# EAGLE design MoleNet_v3.0 (EAGLE 7.6.0)
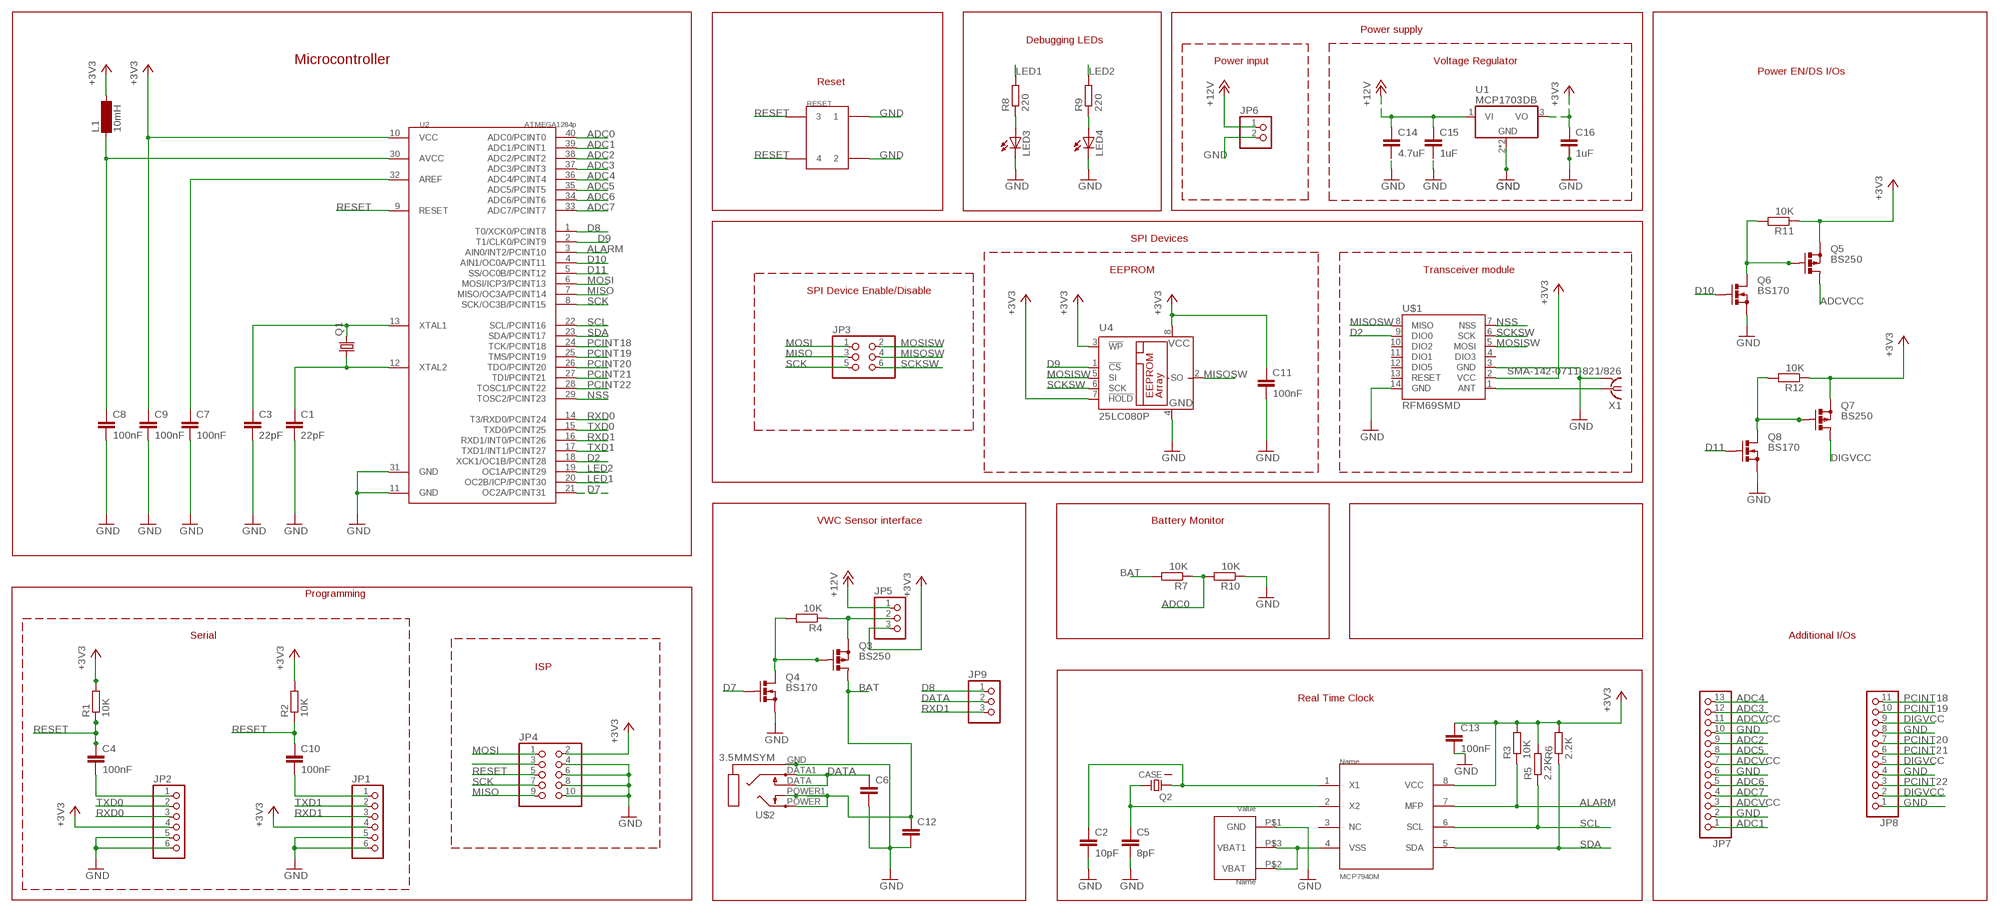
[diagram p0: schematic, sheet 1]

## Parts
C1  22pF  C-EU025-025X050  [C025-025X050]
C2  10pF  C-EU025-025X050  [C025-025X050]
C3  22pF  C-EU025-025X050  [C025-025X050]
C4  100nF  C-EU025-025X050  [C025-025X050]
C5  8pF  C-EU025-025X050  [C025-025X050]
C6  C-EU025-025X050  [C025-025X050]
C7  100nF  C-EU025-025X050  [C025-025X050]
C8  100nF  C-EU025-025X050  [C025-025X050]
C9  100nF  C-EU025-025X050  [C025-025X050]
C10  100nF  C-EU025-025X050  [C025-025X050]
C11  100nF  C-EU025-025X050  [C025-025X050]
C12  C-EU025-025X050  [C025-025X050]
C13  100nF  C-EU025-025X050  [C025-025X050]
C14  4.7uF  C-EU025-025X050  [C025-025X050]
C15  1uF  C-EU025-025X050  [C025-025X050]
C16  1uF  C-EU025-025X050  [C025-025X050]
JP1  PINHD-1X6  [1X06]
JP2  PINHD-1X6  [1X06]
JP3  PINHD-2X3  [2X03]
JP4  PINHD-2X5  [2X05]
JP5  PINHD-1X3  [1X03]
JP6  PINHD-1X2  [1X02]
JP7  PINHD-1X13  [1X13]
JP8  PINHD-1X11  [1X11]
JP9  PINHD-1X3  [1X03]
L1  10mH  BS11  [BS11]
LED3  LEDLD260  [LD260]
LED4  LEDLD260  [LD260]
Q1  CRYSTALHC18U-V  [HC18U-V]
Q2  MS1V-T1K-32.768KHZ/12.5PF/20PPM/TA/QC  [MS1V-T1K]
Q3  BS250  [SOT54E]
Q4  BS170  [SOT54E]
Q5  BS250  [SOT54E]
Q6  BS170  [SOT54E]
Q7  BS250  [SOT54E]
Q8  BS170  [SOT54E]
R1  10K  R-EU_0207/10  [0207/10]
R2  10K  R-EU_0207/10  [0207/10]
R3  10K  R-EU_0207/10  [0207/10]
R4  10K  R-EU_0207/10  [0207/10]
R5  2.2K  R-EU_0207/10  [0207/10]
R6  2.2K  R-EU_0207/10  [0207/10]
R7  10K  R-EU_0207/10  [0207/10]
R8  220  R-EU_0207/10  [0207/10]
R9  220  R-EU_0207/10  [0207/10]
R10  10K  R-EU_0207/10  [0207/10]
R11  10K  R-EU_0207/10  [0207/10]
R12  10K  R-EU_0207/10  [0207/10]
RESET  RESDEV  [PDIP-4]
U1  MCP1703DB  [SOT223]
U2  ATMEGA1284p  MEGA1284P  [DIL40]
U4  25LC080P  [DIL8]
U5  MCP7940M  [DIP8]
U7  BATHOLDER  [BATDIP]
U$1  RFM69SMD  [RFM69]
U$2  3.5MMSYM  [PDIP5]
X1  SMA-142-0711-821/826  [J502-ND-142-0711-821/826]

## Nets
+3V3: C9.1 C11.1 C13.1 C16.1 JP1.4 JP2.4 JP4.2 JP5.3 L1.2 Q5.S Q7.S R1.2 R2.2 R3.2 R5.2 R6.2 R11.1 R12.1 U1.3(VO) U2.10(VCC) U4.3(!WP) U4.7(!HOLD) U4.8(VCC) U5.8(VCC) U$1.2(VCC)
+12V: C14.1 C15.1 JP5.1 JP6.1 U1.1(VI)
ADC0: R7.1 R10.2 U2.40(ADC0/PCINT0)
ADC1: JP7.1 U2.39(ADC1/PCINT1)
ADC2: JP7.9 U2.38(ADC2/PCINT2)
ADC3: JP7.12 U2.37(ADC3/PCINT3)
ADC4: JP7.13 U2.36(ADC4/PCINT4)
ADC5: JP7.8 U2.35(ADC5/PCINT5)
ADC6: JP7.5 U2.34(ADC6/PCINT6)
ADC7: JP7.4 U2.33(ADC7/PCINT7)
ADCVCC: JP7.3 JP7.7 JP7.11 Q5.D
ALARM: R3.1 U2.3(AIN0/INT2/PCINT10) U5.7(MFP)
BAT: C12.1 JP5.2 Q3.D Q3.S R4.1 R7.2 U$2.POWER U$2.POWER1
D2: U2.18(XCK1/OC1B/PCINT28) U$1.9(DIO0)
D7: Q4.G U2.21(OC2A/PCINT31)
D8: JP9.1 U2.1(T0/XCK0/PCINT8)
D9: U2.2(T1/CLK0/PCINT9) U4.1(!CS)
D10: Q6.G U2.4(AIN1/OC0A/PCINT11)
D11: Q8.G U2.5(SS/OC0B/PCINT12)
DATA: C6.1 JP9.2 U$2.DATA U$2.DATA1
DIGVCC: JP8.2 JP8.5 JP8.9 Q7.D
GND: C1.2 C2.2 C3.2 C5.2 C6.2 C7.2 C8.2 C9.2 C11.2 C12.2 C13.2 C14.2 C15.2 C16.2 JP1.5 JP1.6 JP2.5 JP2.6 JP4.4 JP4.6 JP4.8 JP4.10 JP6.2 JP7.2 JP7.6 JP7.10 JP8.1 JP8.4 JP8.8 LED3.K(C) LED4.K(C) Q4.S Q6.S Q8.S R10.1 RESET.1 RESET.2 U1.2(GND) U1.4(GND) U2.11(GND) U2.31(GND) U4.4(GND) U7.P$1(GND) U$1.3(GND) U$1.14(GND) U$2.GND X1.G@1 X1.G@2 X1.G@3 X1.G@4
LED1: R8.2 U2.20(OC2B/ICP/PCINT30)
LED2: R9.2 U2.19(OC1A/PCINT29)
MISO: JP3.3 JP4.9 U2.7(MISO/OC3A/PCINT14)
MISOSW: JP3.4 U4.2(SO) U$1.8(MISO)
MOSI: JP3.1 JP4.1 U2.6(MOSI/ICP3/PCINT13)
MOSISW: JP3.2 U4.5(SI) U$1.5(MOSI)
N$1: C3.1 Q1.2 U2.13(XTAL1)
N$2: C1.1 Q1.1 U2.12(XTAL2)
N$3: C2.1 Q2.1 U5.1(X1)
N$4: C5.1 Q2.2 U5.2(X2)
N$5: C7.1 U2.32(AREF)
N$6: C4.2 JP2.1
N$7: C8.1 L1.1 U2.30(AVCC)
N$8: C10.2 JP1.1
N$9: U$1.1(ANT) X1.1
N$10: Q5.G Q6.D R11.2
N$11: JP4.3
N$12: LED3.A R8.1
N$13: Q3.G Q4.D R4.2
N$14: LED4.A R9.1
N$15: U5.4(VSS) U7.P$2(VBAT) U7.P$3(VBAT1)
N$30: Q7.G Q8.D R12.2
NSS: U2.29(TOSC2/PCINT23) U$1.7(NSS)
PCINT18: JP8.11 U2.24(TCK/PCINT18)
PCINT19: JP8.10 U2.25(TMS/PCINT19)
PCINT20: JP8.7 U2.26(TDO/PCINT20)
PCINT21: JP8.6 U2.27(TDI/PCINT21)
PCINT22: JP8.3 U2.28(TOSC1/PCINT22)
RESET: C4.1 C10.1 JP4.5 R1.1 R2.1 RESET.3 RESET.4 U2.9(RESET)
RXD0: JP2.3 U2.14(T3/RXD0/PCINT24)
RXD1: JP1.3 JP9.3 U2.16(RXD1/INT0/PCINT26)
SCK: JP3.5 JP4.7 U2.8(SCK/OC3B/PCINT15)
SCKSW: JP3.6 U4.6(SCK) U$1.6(SCK)
SCL: R5.1 U2.22(SCL/PCINT16) U5.6(SCL)
SDA: R6.1 U2.23(SDA/PCINT17) U5.5(SDA)
TXD0: JP2.2 U2.15(TXD0/PCINT25)
TXD1: JP1.2 U2.17(TXD1/INT1/PCINT27)
Unconnected: Q2.CASE U5.3(NC) U$1.4(DIO3) U$1.10(DIO2) U$1.11(DIO1) U$1.12(DIO5)

## Notes on the sheet
- Power supply
- Debugging LEDs
- Microcontroller | Power input | Voltage Regulator
- Power EN/DS I/Os
- Reset
- SPI Devices
- EEPROM | Transceiver module
- SPI Device Enable/Disable
- VWC Sensor interface | Battery Monitor
- Programming
- Serial | Additional I/Os
- ISP
- Real Time Clock

## Power pins joined to a net without a drawn wire
RESET: U$1.13(RESET)

## Library data of the parts
C1-C16 = rcl:C-EU: CAPACITOR, European symbol
JP1 JP2 = pinhead:PINHD-1X6: PIN HEADER
JP3 = pinhead:PINHD-2X3: PIN HEADER
JP4 = pinhead:PINHD-2X5: PIN HEADER
JP5 JP9 = pinhead:PINHD-1X3: PIN HEADER
JP6 = pinhead:PINHD-1X2: PIN HEADER
JP7 = pinhead:PINHD-1X13: PIN HEADER
JP8 = pinhead:PINHD-1X11: PIN HEADER
L1 = inductor-neosid:BS: INDUCTOR nominal inductance, magnetically screened; OC_FARNELL: unknown; OC_NEWARK: unknown
LED3 LED4 = led:LED: LED OSRAM: - CHIPLED LG R971, LG N971, LY N971, LG Q971, LY Q971, LO R971, LY R971 LH N974, LH R974 LS Q976, LO Q976, LY Q976 LO Q996 - Hyper CHIPLED LW Q18S LB Q993, LB Q99A, LB R99A - SideLED LS A670, LO A670, LY A670, LG A670, LP A670 LB A673, LV A673, LT A673, LW A673 LH A674 LY A675 LS A676, LA A676, LO A676, LY A676, LW A676 LS A679, LY A679, LG A679 - Hyper Micro SIDELED® LS Y876, LA Y876, LO Y876, LY Y876 LT Y87S - SmartLED LW L88C, LW L88S LB L89C, LB L89S, LG L890 LS L89K, LO L89K, LY L89K LS L896, LA L896, LO L896, LY L896 - TOPLED LS T670, LO T670, LY T670, LG T670, LP T670 LSG T670, LSP T670, LSY T670, LOP T670, LYG T670 LG T671, LOG T671, LSG T671 LB T673, LV T673, LT T673, LW T673 LH T674 LS T676, LA T676, LO T676, LY T676, LB T676, LH T676, LSB T676, LW T676 LB T67C, LV T67C, LT T67C, LS T67K, LO T67K, LY T67K, LW E67C LS E67B, LA E67B, LO E67B, LY E67B, LB E67C, LV E67C, LT E67C LW T67C LS T679, LY T679, LG T679 LS T770, LO T770, LY T770, LG T770, LP T770 LB T773, LV T773, LT T773, LW T773 LH T774 LS E675, LA E675, LY E675, LS T675 LS T776, LA T776, LO T776, LY T776, LB T776 LHGB T686 LT T68C, LB T68C - Hyper Mini TOPLED® LB M676 - Mini TOPLED Santana® LG M470 LS M47K, LO M47K, LY M47K Source: http://www.osram.convergy.de LUXEON: - LUMILED® LXK2-PW12-R00, LXK2-PW12-S00, LXK2-PW14-U00, LXK2-PW14-V00 LXK2-PM12-R00, LXK2-PM12-S00, LXK2-PM14-U00 LXK2-PE12-Q00, LXK2-PE12-R00, LXK2-PE12-S00, LXK2-PE14-T00, LXK2-PE14-U00 LXK2-PB12-K00, LXK2-PB12-L00, LXK2-PB12-M00, LXK2-PB14-N00, LXK2-PB14-P00, LXK2-PB14-Q00 LXK2-PR12-L00, LXK2-PR12-M00, LXK2-PR14-Q00, LXK2-PR14-R00 LXK2-PD12-Q00, LXK2-PD12-R00, LXK2-PD12-S00 LXK2-PH12-R00, LXK2-PH12-S00 LXK2-PL12-P00, LXK2-PL12-Q00, LXK2-PL12-R00 Source: www.luxeon.com KINGBRIGHT: KA-3528ASYC Source: www.kingbright.com
Q1 = crystal:CRYSTAL: CRYSTAL; OC_FARNELL: unknown; OC_NEWARK: unknown
Q2 = crystal_MS1V-T1K:MS1V-T1K-*: p r e l i m i n a r y 5 . 0 . 0 MS1V-T1K Crystaly source: www.microcrystal.com
Q3 Q5 Q7 = transistor-small-signal:BS250: P-CHANNEL MOS FET
Q4 Q6 Q8 = transistor-small-signal:BS170: N-CHANNEL MOS FET
R1-R12 = rcl:R-EU_: RESISTOR, European symbol
RESET = resetswitch:RESDEV
U1 = mcp1703:MCP1703: 250 mA, 16V, Low Quiescent Current LDO Regulator Source: http://ww1.microchip.com/downloads/en/DeviceDoc/22049b.pdf
U2 = 1284p:MEGA1284P: Atmel ATmega1284P 8-bit AVR Microcontroller
U4 = microchip:25*: Serial EEPROM 4K/ 8K , SPI bus; MF: MICROCHIP; MPN: 25LC080/P; OC_FARNELL: 1556143; OC_NEWARK: 92C7440
U5 = mcp7940m:MCP7940M
U7 = batholder:BATHOLDER
U$1 = RFM69:RFM69: The RFM22 is a low-power, low cost radio that is capable of operating in the 434MHz and 900MHz open bands. It's frequency is software defined and there are some very good libraries written for it.
U$2 = 3.5mmjack:3.5MMSYM
X1 = con-coax:SMA-: SMA 50 Ohm End Launch Jack Receptacle - Round Contact Johnson Components Source: www.johnsoncomponents.com .. J502-ND.pdf; MF: JOHNSON COMPONENTS; MPN: 142-0711-821; OC_FARNELL: 1019328; OC_NEWARK: 16F3627

## Board
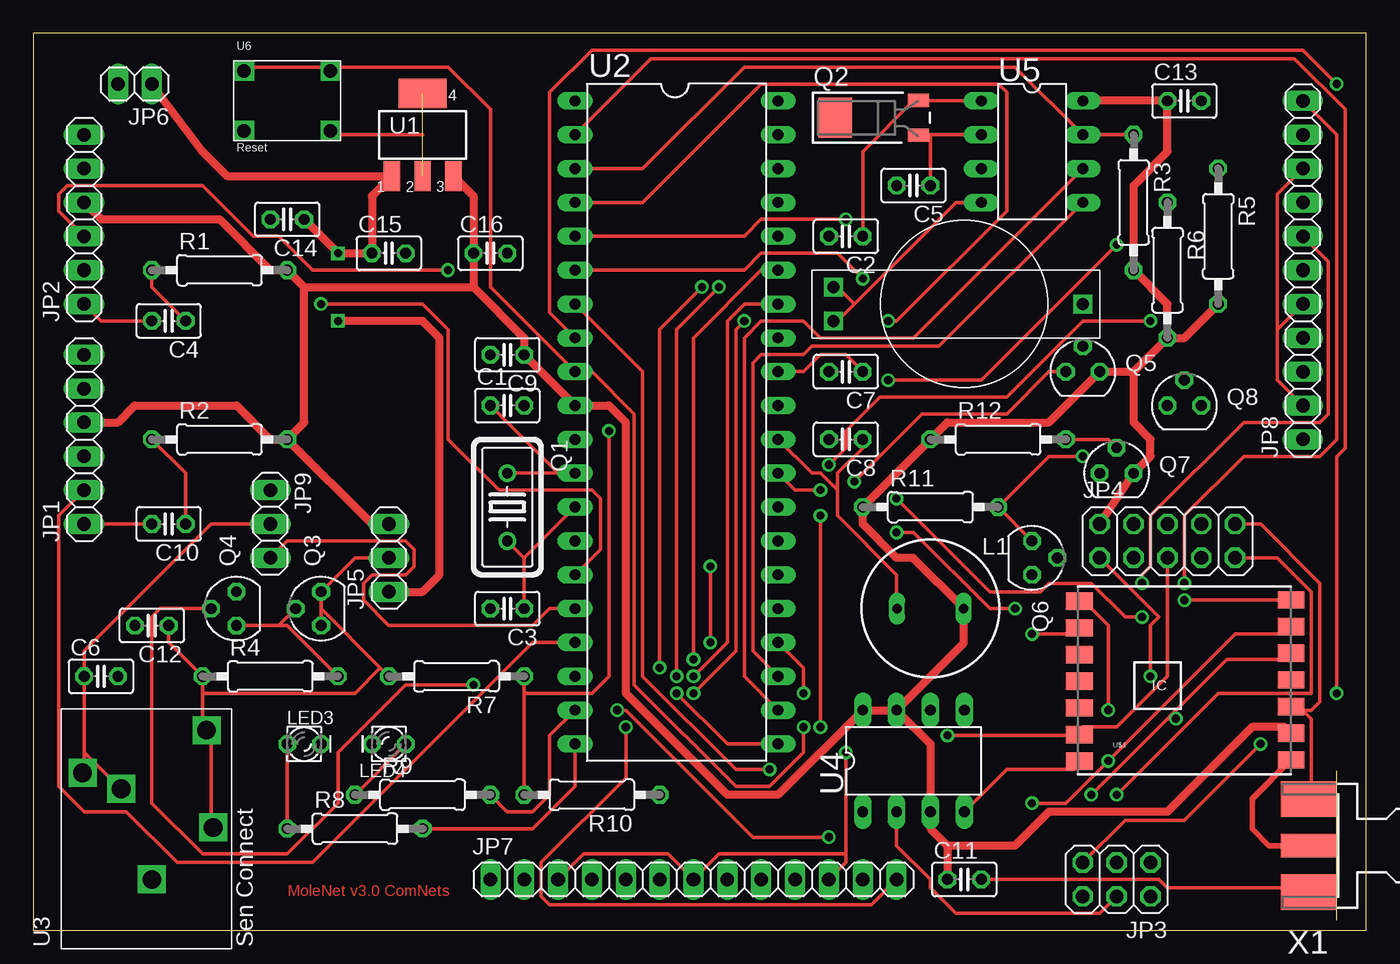
[diagram p1: board, top side]
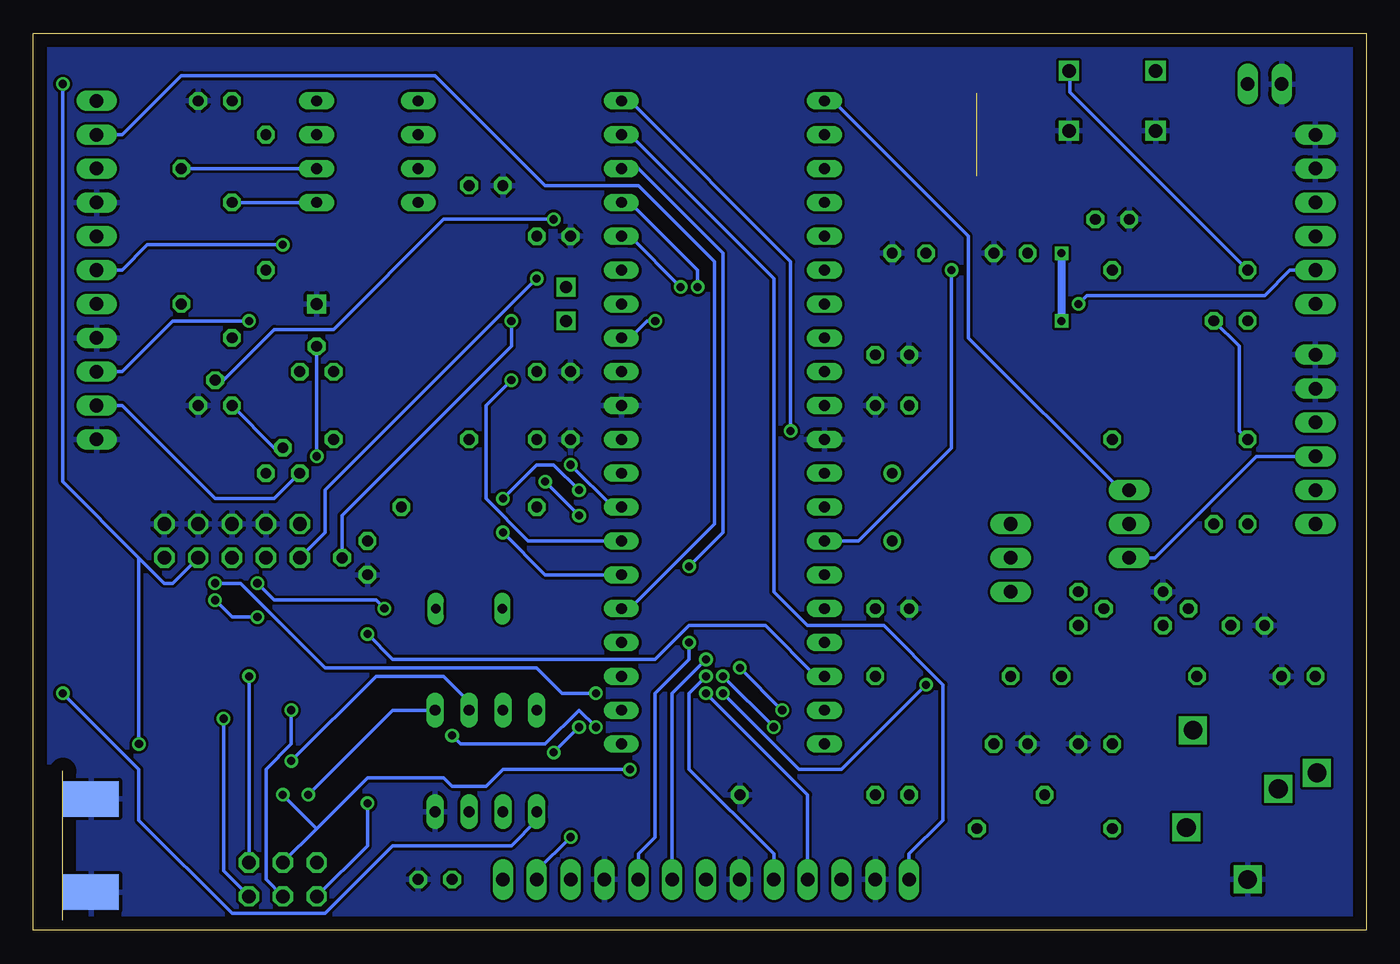
[diagram p2: board, bottom side, seen from below]

Size 100 x 67.3 mm. Coordinates in mm from the lower left corner, seen from the top.
Outline: 0,0 100,0 100,67.3 0,67.3 0,0
Copper layers (1*16): Top 0.035mm / dielectric 1.5mm / Bottom 0.035mm
Design rules "default": minimum track width 10mil, minimum drill 24mil, track to track 8mil, track to pad 8mil, pad to pad 8mil, via to via 8mil, smd to smd 8mil, copper to edge 40mil, drill to drill 8mil, minimum pad ring 10mil, minimum via ring 8mil, stop-mask expansion 4mil, vias tented up to drill 0mil, thermal gap 10mil

### Footprints (pad centres in the part's own frame; a part is rotated, then mirrored left to right if it is on the bottom)
C025-025X050 = drill 0.813 octagon: 1 -1.27,0; 2 1.27,0
1X06 = drill 1.016 long: 1 -6.35,0; 2 -3.81,0; 3 -1.27,0; 4 1.27,0; 5 3.81,0; 6 6.35,0
2X03 = drill 1.016 octagon: 1 -2.54,-1.27; 2 -2.54,1.27; 3 0,-1.27; 4 0,1.27; 5 2.54,-1.27; 6 2.54,1.27
2X05 = drill 1.016 octagon: 1 -5.08,-1.27; 2 -5.08,1.27; 3 -2.54,-1.27; 4 -2.54,1.27; 5 0,-1.27; 6 0,1.27; 7 2.54,-1.27; 8 2.54,1.27; 9 5.08,-1.27; 10 5.08,1.27
1X03 = drill 1.016 long: 1 -2.54,0; 2 0,0; 3 2.54,0
1X02 = drill 1.016 long: 1 -1.27,0; 2 1.27,0
1X13 = drill 1.016 long: 1 -15.24,0; 2 -12.7,0; 3 -10.16,0; 4 -7.62,0; 5 -5.08,0; 6 -2.54,0; 7 0,0; 8 2.54,0; 9 5.08,0; 10 7.62,0; 11 10.16,0; 12 12.7,0; 13 15.24,0
1X11 = drill 1.016 long: 1 -12.7,0; 2 -10.16,0; 3 -7.62,0; 4 -5.08,0; 5 -2.54,0; 6 0,0; 7 2.54,0; 8 5.08,0; 9 7.62,0; 10 10.16,0; 11 12.7,0
BS11 = drill 0.7 long: 1 -2.5,0; 2 2.5,0
LD260 = drill 0.813 octagon: A -1.27,0; K 1.27,0
HC18U-V = drill 0.813: 1 -2.54,0; 2 2.54,0
MS1V-T1K = smd 1.6 x 1: 1 2.9,1.3; 2 2.9,-1.3 | smd 2.5 x 3: CASE -3.35,0
SOT54E = drill 0.813 octagon: D -1.27,0; G 0,1.905; S 1.27,0
0207/10 = drill 0.813 octagon: 1 -5.08,0; 2 5.08,0
PDIP-4 = drill 1 square: 1 3.25,-2.25; 2 -3.25,-2.25; 3 3.25,2.25; 4 -3.25,2.25
SOT223 = smd 1.219 x 2.235: 1 -2.311,-3.099; 2 0,-3.099; 3 2.311,-3.099 | smd 3.6 x 2.2: 4 0,3.099
DIL40 = drill 0.813 long: 1 -24.13,-7.62; 2 -21.59,-7.62; 3 -19.05,-7.62; 4 -16.51,-7.62; 5 -13.97,-7.62; 6 -11.43,-7.62; 7 -8.89,-7.62; 8 -6.35,-7.62; 9 -3.81,-7.62; 10 -1.27,-7.62; 11 1.27,-7.62; 12 3.81,-7.62; 13 6.35,-7.62; 14 8.89,-7.62; 15 11.43,-7.62; 16 13.97,-7.62; 17 16.51,-7.62; 18 19.05,-7.62; 19 21.59,-7.62; 20 24.13,-7.62; 21 24.13,7.62; 22 21.59,7.62; 23 19.05,7.62; 24 16.51,7.62; 25 13.97,7.62; 26 11.43,7.62; 27 8.89,7.62; 28 6.35,7.62; 29 3.81,7.62; 30 1.27,7.62; 31 -1.27,7.62; 32 -3.81,7.62; 33 -6.35,7.62; 34 -8.89,7.62; 35 -11.43,7.62; 36 -13.97,7.62; 37 -16.51,7.62; 38 -19.05,7.62; 39 -21.59,7.62; 40 -24.13,7.62
DIL8 = drill 0.813 long: 1 -3.81,-3.81; 2 -1.27,-3.81; 3 1.27,-3.81; 4 3.81,-3.81; 5 3.81,3.81; 6 1.27,3.81; 7 -1.27,3.81; 8 -3.81,3.81
DIP8 = drill 0.813 long: 1 -3.81,3.81; 2 -3.81,1.27; 3 -3.81,-1.27; 4 -3.81,-3.81; 5 3.81,-3.81; 6 3.81,-1.27; 7 3.81,1.27; 8 3.81,3.81
BATDIP = drill 0.9 square: P$1 0,0; P$2 18.7,-1.27; P$3 18.7,1.27
RFM69 = smd 2 x 1.3: 1 8,-6.27; 2 8,-4.27; 3 8,-2.27; 4 8,-0.27; 5 8,1.73; 6 8,3.73; 7 8,5.73; 8 -7.875,5.635; 9 -7.875,3.635; 10 -7.875,1.635; 11 -7.875,-0.365; 12 -7.875,-2.365; 13 -7.875,-4.365; 14 -7.875,-6.365
PDIP5 = drill 1.4 square: DATA 6.8,2.3; DATA1 8,5.2; GND 0,0; POWER 3.9,-4.6; POWER1 11.2,-4.1
J502-ND-142-0711-821/826 = smd 4.191 x 1.778: 1 2.115,0 | smd 4.191 x 2.667: G@1 2.115,3.495; G@2 2.115,-3.495 | smd 4.191 x 2.667 bottom: G@3 2.115,3.495; G@4 2.115,-3.495

### Placement (x,y rotation side)
C1  35.56,39.37 0 top
C2  60.96,52.07 180 top
C3  35.56,24.13 180 top
C4  10.16,45.72 180 top
C5  66.04,55.88 180 top
C6  5.08,19.05 0 top
C7  60.96,41.91 180 top
C8  60.96,36.83 180 top
C9  35.56,43.18 180 top
C10  10.16,30.48 180 top
C11  69.85,3.81 0 top
C12  8.89,22.86 180 top
C13  86.36,62.23 0 top
C14  19.05,53.34 180 top
C15  26.67,50.8 0 top
C16  34.29,50.8 0 top
JP1  3.81,36.83 90 top
JP2  3.81,53.34 90 top
JP3  81.28,3.81 180 top
JP4  85.09,29.21 0 top
JP5  26.67,27.94 90 top
JP6  7.62,63.5 180 top
JP7  49.53,3.81 0 top
JP8  95.25,49.53 90 top
JP9  17.78,30.48 270 top
L1  67.31,24.13 0 top
LED3  20.32,13.97 0 top
LED4  26.67,13.97 180 top
Q1  35.56,31.75 270 top
Q2  63.5,60.96 0 top
Q3  21.59,24.13 90 top
Q4  15.24,24.13 90 top
Q5  78.74,41.91 0 top
Q6  74.93,27.94 270 top
Q7  81.28,34.29 0 top
Q8  86.36,39.37 0 top
R1  13.97,49.53 0 top
R2  13.97,36.83 0 top
R3  82.55,54.61 270 top
R4  17.78,19.05 0 top
R5  88.9,52.07 270 top
R6  85.09,49.53 270 top
R7  31.75,19.05 180 top
R8  24.13,7.62 0 top
R9  29.21,10.16 0 top
R10  41.91,10.16 180 top
R11  67.31,31.75 0 top
R12  72.39,36.83 0 top
RESET  19.05,62.23 0 top
U1  29.21,59.69 0 top
U2  48.26,38.1 270 top
U4  66.04,12.7 0 top
U5  74.93,58.42 0 top
U7  78.74,46.99 180 top
U$1  86.36,19.05 0 top
U$2  8.89,3.81 90 top
X1  97.79,6.35 180 top

### Tracks (layer width: path | path; a pad name or v marks a point on that pad's centre or on a via)
+3V3
  Top 0.61: U1.3 33.02,55.09 C16.1 33.02,48.26 | 33.02,48.26 36.83,44.45 C9.1 U2.10 43.18,39.37 44.45,38.1 44.45,17.78 52.07,10.16 55.88,10.16 U4.8 U4.7 | 20.32,48.26 R1.2 17.78,49.53 13.97,53.34 5.08,53.34 JP2.4 | 20.32,48.26 33.02,48.26 | R2.2 20.32,38.1 20.32,48.26 | JP1.4 6.35,38.1 7.62,39.37 15.24,39.37 17.78,36.83 R2.2 | R2.2 25.4,30.48 JP5.3 | U4.7 69.81,21.55 L1.2 66,27.94 64.77,27.94 62.23,30.48 R11.1 R12.1 68.58,38.1 76.2,38.1 Q5.S 82.55,41.91 | 82.55,41.91 R6.2 | R6.2 86.36,44.45 R5.2 | R6.2 85.09,46.99 R3.2 82.55,55.88 85.09,58.42 C13.1 U5.8 | JP4.2 Q7.S 83.82,35.56 83.82,36.83 82.55,38.1 82.55,41.91 | U$1.2 93.9,15.24 91.44,15.24 85.09,8.89 76.2,8.89 73.66,6.35 68.58,6.35 | 68.58,6.35 67.31,7.62 U4.3 67.31,13.97 U4.7 | 68.58,6.35 C11.1
+12V  (via drill 0.6)
  Top 0.61: JP6.1 12.7,58.42 14.53,56.59 U1.1 25.4,55.09 C15.1 v22.86,50.8 C14.1 | JP5.1 29.21,25.4 30.48,26.67 30.48,44.45 29.21,45.72 v22.86,45.72
  Bottom 0.61: v22.86,50.8 v22.86,45.72
ADC0  (via drill 0.61)
  Top 0.254: R7.1 36.83,17.78 | 36.83,17.78 R10.2 | v43.18,37.46 43.18,19.05 41.91,17.78 36.83,17.78
  Bottom 0.254: U2.40 55.25,62.23 43.18,50.16 v43.18,37.46
ADC1
  Bottom 0.254: U2.39 55.25,59.69 44.45,48.9 44.45,25.4 41.91,22.86 36.2,22.86 31.75,18.41 31.75,8.26 34.29,5.71 JP7.1
ADC2  (via drill 0.61)
  Top 0.254: v50.8,21.59 v50.8,27.3
  Bottom 0.254: U2.38 54.61,57.15 48.26,50.8 48.26,29.84 v50.8,27.3 | v50.8,21.59 50.8,20.32 53.34,17.78 53.34,6.99 54.61,5.71 JP7.9
ADC3  (via drill 0.61)
  Top 0.254: v50.16,48.26 46.99,45.09 v46.99,19.68 | v43.82,16.51 44.45,16.51 53.98,6.99 v59.69,6.99
  Bottom 0.254: U2.37 55.25,54.61 50.16,49.53 v50.16,48.26 | v43.82,16.51 v46.99,19.68 | v59.69,6.99 62.23,4.44 JP7.12
ADC4  (via drill 0.61)
  Top 0.254: v51.44,48.26 48.26,45.09 v48.26,19.05 | v44.45,15.24 44.45,11.43 38.1,5.08 38.1,2.54 38.73,1.9 62.86,1.9 JP7.13
  Bottom 0.254: U2.36 55.25,52.07 v51.44,48.26 | v44.45,15.24 v48.26,19.05
ADC5  (via drill 0.61)
  Top 0.254: U2.35 54.61,49.53 49.53,44.45 v49.53,20.32
  Bottom 0.254: v49.53,20.32 52.07,17.78 JP7.8
ADC6  (via drill 0.61)
  Top 0.254: U2.34 53.34,46.99 52.07,45.72 52.07,21.59 v49.53,19.05
  Bottom 0.254: v49.53,19.05 50.8,17.78 50.8,12.06 44.45,5.71 JP7.5
ADC7  (via drill 0.61)
  Top 0.254: v53.34,45.72 52.7,45.09 52.7,20.95 v49.53,17.78
  Bottom 0.254: U2.33 55.25,44.45 53.98,45.72 v53.34,45.72 | v49.53,17.78 41.91,10.16 JP7.4
ADCVCC  (via drill 0.61)
  Top 0.254: JP7.3 41.27,5.71 47.62,5.71 JP7.7 51.44,5.71 60.96,5.71 | Q5.D 76.2,41.91 73.03,38.73 66.67,38.73 v61.59,33.66 | v59.06,15.24 v59.06,31.11 | 60.96,5.71 60.96,5.08 JP7.11 | 60.96,5.71 v60.96,13.33
  Bottom 0.254: v59.06,31.11 v61.59,33.66 | v60.96,13.33 v59.06,15.24
ALARM
  Top 0.254: U2.3 45.72,57.15 53.34,64.77 73.66,64.77 U5.7 R3.1
BAT
  Top 0.254: 21.59,24.13 Q3.S 24.13,27.94 JP5.2 | 21.59,24.13 Q3.D | 21.59,24.13 26.03,19.68 | 26.03,19.68 R7.2 | 12.7,17.78 12.7,15.24 U$2.POWER1 13.33,14.6 13.33,8.26 U$2.POWER | 12.7,17.78 R4.1 10.16,21.59 C12.1 | 26.03,19.68 24.13,17.78 12.7,17.78
D2  (via drill 0.61)
  Top 0.254: v74.93,22.23 78.11,22.23 U$1.9
  Bottom 0.254: v74.93,22.23 73.03,20.32 53.34,20.32 50.8,22.86 45.09,22.86 41.27,19.05 U2.18
D7  (via drill 0.61)
  Top 0.254: Q4.G 9.53,24.13 8.89,23.49 8.89,9.53 12.7,5.71 19.05,5.71 22.86,9.53 22.86,13.33 27.94,18.41 v33.02,18.41 | v48.26,17.78 52.07,13.97 U2.21
  Bottom 0.254: v33.02,18.41 39.37,12.06 42.55,12.06 v48.26,17.78
D8
  Bottom 0.254: U2.1 40.01,62.23 29.84,52.07 29.84,44.45 18.41,33.02 JP9.1
D9  (via drill 0.61)
  Top 0.254: v97.79,17.78 97.79,35.56 98.42,36.2 98.42,61.59 94.61,65.41 46.36,65.41 U2.2
  Bottom 0.254: U4.1 62.23,8.26 64.14,6.35 73.03,6.35 78.11,1.27 85.09,1.27 92.08,8.26 92.08,12.06 v97.79,17.78
D10  (via drill 0.61)
  Top 0.254: U2.4 45.72,54.61 54.61,63.5 72.39,63.5 73.03,62.87 73.03,53.98 64.77,45.72 v64.14,45.72
  Bottom 0.254: v64.14,45.72 64.14,43.81 76.84,31.11 Q6.G
D11  (via drill 0.61)
  Top 0.254: U2.5 53.34,52.07 54.61,53.34 v60.96,53.34
  Bottom 0.254: v60.96,53.34 69.22,53.34 77.47,45.09 81.92,45.09 85.73,41.27 Q8.G
DATA
  Top 0.254: 3.81,13.33 3.81,12.06 U$2.DATA1 | 3.81,13.33 C6.1 3.81,20.95 13.33,30.48 JP9.2 | 3.81,13.33 6.35,10.79 U$2.DATA
DIGVCC
  Top 0.254: 93.34,45.09 JP8.5 | 93.34,45.09 93.34,41.27 JP8.2 | JP8.9 93.34,55.24 93.34,45.09
  Bottom 0.254: Q7.D 81.92,32.38 86.36,32.38 93.34,39.37 JP8.2
GND  (2 unrouted)
  Top 0.254: 95.25,16.51 94.61,16.51 U$1.3 95.25,16.51 | 95.25,16.51 95.89,15.87 95.89,10.16 X1.G@4 | U4.4 73.03,12.06 78.11,12.06 U$1.14 | C11.2 84.45,3.81 85.09,3.17 95.25,3.17 X1.G@3 | 29.21,59.69 22.86,59.69 RESET.1 | 95.25,16.51 95.89,16.51 96.52,17.14 96.52,26.03 92.08,30.48 JP4.10
  pour Bottom: 0,67.31 99.06,67.31 99.06,0 0,0
LED1
  Top 0.254: R8.2 37.47,7.62 40.64,10.79 U2.20
LED2
  Top 0.254: R9.2 35.56,8.89 37.47,8.89 38.73,10.16 38.73,14.6 U2.19
MISO  (via drill 0.61)
  Top 0.254: U2.7 45.72,41.91 45.72,19.05 52.7,12.06 v55.25,12.06 | JP4.9 93.34,27.94 95.89,25.4 95.89,17.78 88.9,17.78 v81.28,10.16
  Bottom 0.254: v55.25,12.06 64.77,12.06 66.04,10.79 68.58,10.79 69.22,11.43 74.93,11.43 78.74,7.62 | JP3.3 78.74,7.62 | 78.74,7.62 v81.28,10.16
MISOSW  (via drill 0.61)
  Top 0.254: v80.64,16.51 80.64,22.86 79.38,24.13 78.74,24.13 U$1.8 | U4.2 64.77,6.35 67.31,3.81 67.31,3.17 69.22,1.27 80.01,1.27 JP3.4
  Bottom 0.254: v80.64,16.51 80.64,13.97 82.55,12.06 82.55,3.81 JP3.4
MOSI  (via drill 0.61)
  Top 0.254: U2.6 53.34,49.53 54.61,50.8 60.33,50.8 v62.23,48.9 | v83.82,19.05 83.82,22.86 84.45,23.49 JP4.1
  Bottom 0.254: v62.23,48.9 78.11,33.02 78.11,29.84 JP4.1 | v83.82,19.05 JP3.1
MOSISW  (via drill 0.61)
  Top 0.254: v79.38,10.16 85.09,15.87 | 85.09,15.87 89.53,20.32 93.98,20.32 U$1.5 | 85.09,15.87 v85.73,15.87
  Bottom 0.254: v79.38,10.16 73.03,16.51 U4.5 | JP3.2 85.73,4.44 v85.73,15.87
N$1
  Top 0.254: 36.83,27.94 C3.1 | Q1.2 36.83,27.94 | 36.83,27.94 U2.13
N$2
  Top 0.254: 39.37,34.29 Q1.1 | 39.37,34.29 C1.1 | 39.37,34.29 U2.12
N$3
  Top 0.254: U5.1 66.67,62.23 Q2.1 66.04,62.23 62.23,58.42 C2.1
N$4
  Top 0.254: U5.2 67.31,59.69 | 67.31,59.69 66.67,59.69 Q2.2 | 67.31,59.69 C5.1
N$5
  Top 0.254: U2.32 57.79,41.91 59.06,43.18 60.96,43.18 C7.1
N$6
  Top 0.254: C4.2 5.08,45.72 JP2.1
N$7
  Top 0.254: 60.33,33.02 60.33,34.29 62.23,36.2 C8.1 | 60.33,33.02 60.33,31.11 64.77,26.67 64.77,24.13 L1.1 | U2.30 58.42,34.29 59.06,34.29 60.33,33.02
N$8
  Top 0.254: JP1.1 C10.2
N$9
  Top 0.406: U$1.1 91.44,9.86 91.44,7.62 92.71,6.35 X1.1
N$10  (via drill 0.61)
  Top 0.254: Q6.D R11.2 76.2,35.56 v78.74,35.56
  Bottom 0.254: v78.74,35.56 Q5.G
N$12
  Top 0.254: LED3.A R8.1
N$13
  Top 0.254: 18.41,22.86 Q4.D | Q3.G 18.41,22.86 | R4.2 19.05,22.86 18.41,22.86
N$14
  Top 0.254: LED4.A R9.1
N$15
  Top 0.254: U5.4 69.22,54.61 61.59,46.99 | 61.59,46.99 60.33,45.72 U7.P$3 | 61.59,46.99 60.33,48.26 U7.P$2
N$30
  Top 0.254: R12.2 80.64,36.83 Q7.G
  Bottom 0.254: Q8.D 81.92,36.2 Q7.G
NSS  (via drill 0.61)
  Top 0.254: v86.36,24.77 93.98,24.77 U$1.7 | v83.19,23.49 81.92,23.49 79.38,26.03 76.2,26.03 75.56,25.4 71.75,25.4 v64.77,32.38 | v59.06,33.02 57.15,33.02 U2.29
  Bottom 0.254: v86.36,24.77 85.09,23.49 v83.19,23.49 | v64.77,32.38 62.23,34.92 60.96,34.92 v59.06,33.02
PCINT18  (via drill 0.61)
  Top 0.254: U2.24 57.79,19.68 v57.79,17.78 | v86.36,26.03 86.36,31.11 90.81,35.56 96.52,35.56 97.79,36.83 97.79,59.69 JP8.11
  Bottom 0.254: v57.79,17.78 60.33,17.78 62.23,19.68 78.11,19.68 84.45,26.03 v86.36,26.03
PCINT19
  Bottom 0.254: U2.25 55.25,24.13 48.9,30.48 48.9,50.16 54.61,55.88 61.59,55.88 69.85,64.14 88.9,64.14 93.34,59.69 JP8.10
PCINT20  (via drill 0.61)
  Top 0.254: v64.77,29.84 66.04,29.84 71.75,24.13 v73.66,24.13 | v83.19,26.03 83.19,26.67 83.82,27.3 83.82,31.11 90.81,38.1 96.52,38.1 97.16,38.73 97.16,50.16 JP8.7
  Bottom 0.254: U2.26 61.59,26.67 v64.77,29.84 | v73.66,24.13 74.3,24.77 81.92,24.77 v83.19,26.03
PCINT21  (via drill 0.61)
  Top 0.254: v64.14,41.27 71.12,41.27 v81.28,51.43
  Bottom 0.254: U2.27 62.86,29.21 66.04,32.38 66.04,39.37 v64.14,41.27 | v81.28,51.43 91.44,51.43 93.34,49.53 JP8.6
PCINT22  (via drill 0.61)
  Top 0.254: v59.69,34.92 60.96,36.2 60.96,37.46 63.5,40 73.03,40 78.74,45.72 v83.82,45.72
  Bottom 0.254: U2.28 56.52,31.75 v59.69,34.92 | v83.82,45.72 89.53,45.72 93.34,41.91 JP8.3
RESET  (via drill 0.61)
  Top 0.254: R1.1 8.89,48.26 C4.1 | C10.1 11.43,34.29 R2.1 | JP4.5 85.09,19.05 81.28,15.24 78.74,15.24 U$1.13 78.11,14.6 v68.58,14.6 | RESET.4 15.87,64.77 22.23,64.77 RESET.3 22.86,64.77 31.12,64.77 34.29,61.59 34.29,48.26 U2.9 41.91,41.91 45.09,38.73 45.09,18.41 52.7,10.79 55.25,10.79 57.79,13.33 v57.79,15.24
  Bottom 0.254: C4.1 9.53,43.81 9.53,37.46 R2.1 | v68.58,14.6 67.95,13.97 61.59,13.97 59.06,16.51 v57.79,15.24 | R1.1 22.23,62.87 22.23,64.14 RESET.3
RXD0  (via drill 0.61)
  Top 0.254: v31.12,49.53 20.95,49.53 18.41,52.07 16.51,52.07 12.7,55.88 2.54,55.88 1.91,55.24 1.91,53.98 JP2.3
  Bottom 0.254: U2.14 38.1,29.21 31.12,36.2 v31.12,49.53
RXD1
  Top 0.254: U2.16 38.73,24.13 37.47,22.86 26.67,22.86 24.77,24.77 24.77,26.03 25.4,26.67 27.94,26.67 28.58,27.3 28.58,28.57 27.94,29.21 19.05,29.21 JP9.3
  Bottom 0.254: JP1.3 8.26,35.56 15.87,27.94 JP9.3
SCK  (via drill 0.61)
  Top 0.254: U2.8 38.73,46.35 38.73,62.87 41.91,66.04 95.25,66.04 v97.79,63.5 | JP3.5 81.92,8.26 86.36,8.26 v92.08,13.97
  Bottom 0.254: v97.79,63.5 97.79,33.66 92.08,27.94 | 92.08,27.94 90.17,26.03 89.53,26.03 JP4.7 | 92.08,27.94 v92.08,13.97
SCKSW  (via drill 0.61)
  Top 0.254: v74.93,9.53 77.47,9.53 v80.64,12.7 90.17,22.23 93.98,22.23 U$1.6
  Bottom 0.254: v74.93,9.53 74.93,6.35 JP3.6 | U4.6 67.31,17.14 69.22,19.05 74.3,19.05 v80.64,12.7
SCL
  Top 0.254: U2.22 53.34,19.05 53.34,44.45 54.61,45.72 57.79,45.72 59.06,44.45 66.04,44.45 U5.6
  Bottom 0.254: U5.6 R5.1
SDA
  Top 0.254: U2.23 53.98,20.95 53.98,42.54 54.61,43.18 57.79,43.18 58.42,43.81 67.95,43.81 U5.5
  Bottom 0.254: U5.5 R6.1
TXD0  (via drill 0.61)
  Top 0.254: U2.15 42.55,28.57 42.55,32.38 41.91,33.02 34.93,33.02 31.12,36.83 31.12,45.09 29.21,46.99 v21.59,46.99
  Bottom 0.254: v21.59,46.99 20.95,47.62 7.62,47.62 5.71,49.53 JP2.2
TXD1
  Top 0.254: U2.17 37.47,21.59 20.95,5.08 10.79,5.08 6.98,8.89 3.81,8.89 1.91,10.79 1.91,31.11 JP1.2

### Text on the board
Top: MoleNet v3.0 ComNets